# EAGLE design SD card module (EAGLE 5.03)
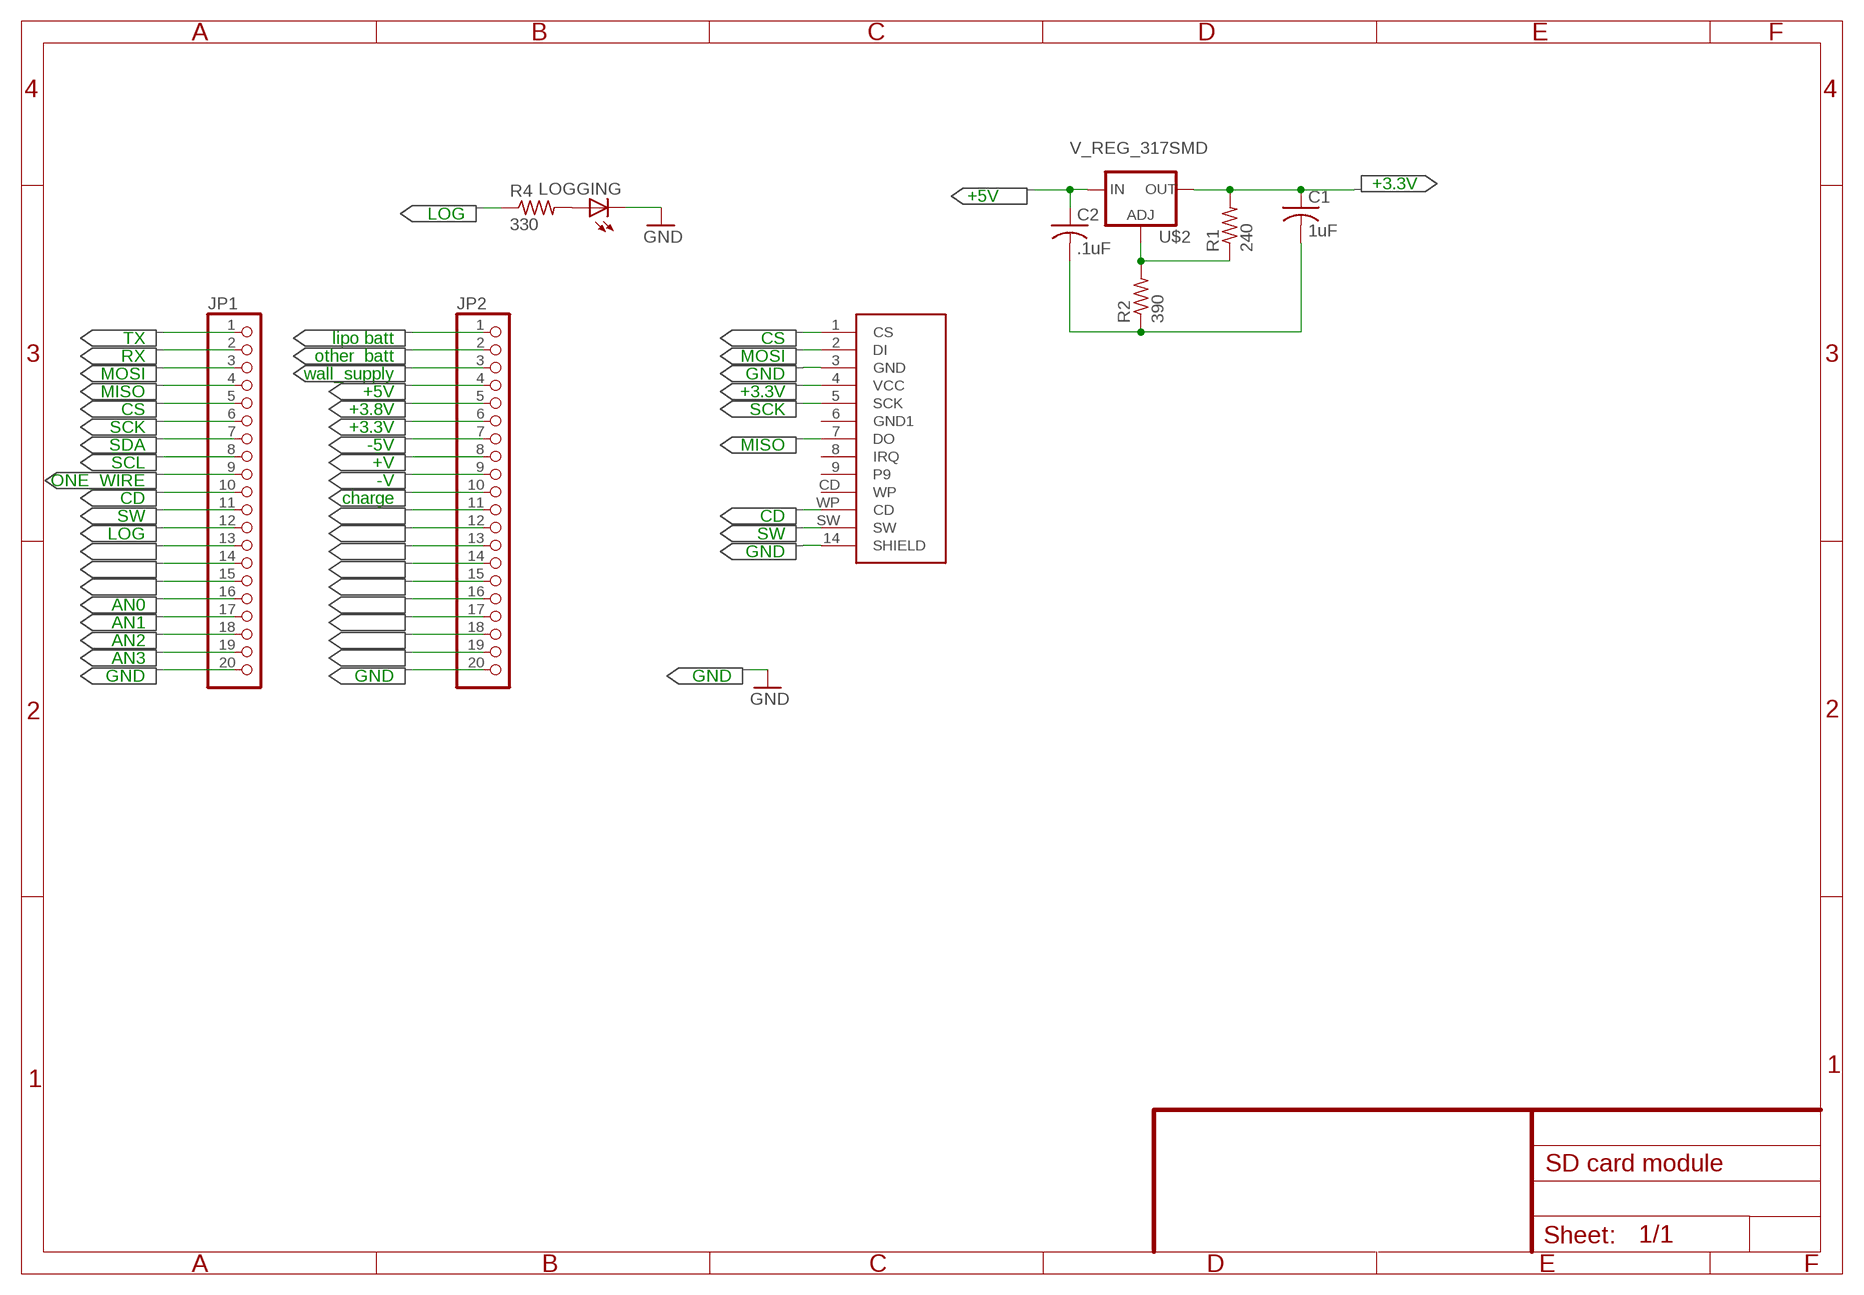
[diagram p0: schematic, sheet 1]

## Parts
C1  1uF  C-USC0603  [C0603]
C2  .1uF  C-USC0603  [C0603]
JP1  PINHD-1X20  [1X20]
JP2  PINHD-1X20  [1X20]
LOGGING  LEDCHIP-LED0603  [CHIP-LED0603]
R1  240  R-US_R0603  [R0603]
R2  390  R-US_R0603  [R0603]
R4  330  R-US_R0603  [R0603]
U$1  SD_CARD_SOCKETSD  [SD-MMC_SOCKET-PP]
U$2  V_REG_317SMD  [SOT223]

## Nets
+3.3V: C1.1 JP2.6 R1.2 U$1.4(VCC) U$2.2(OUT)
+5V: C2.1 JP2.4 U$2.3(IN)
+V: JP2.8
-5V: JP2.7
-V: JP2.9
ALARM: JP1.14
CD: JP1.10 U$1.WP(CD)
CHARGE: JP2.10
CS: JP1.5 U$1.1(CS)
GND: JP1.20 JP2.20 LOGGING.C U$1.3(GND) U$1.14(SHIELD)
LIPO_BATT: JP2.1
LOG: JP1.12 R4.1
MISO: JP1.4 U$1.7(DO)
MOSI: JP1.3 U$1.2(DI)
N$1: JP2.11
N$2: LOGGING.A R4.2
N$4: R1.1 R2.2 U$2.1(ADJ)
N$5: C1.2 C2.2 R2.1
N$6: JP2.12
N$7: JP2.13
N$11: JP2.14
N$12: JP2.15
N$13: JP2.16
N$14: JP2.17
N$15: JP2.18
N$16: JP2.19
N$32: JP1.15
N$33: JP1.16
N$34: JP1.17
N$35: JP1.18
N$36: JP1.19
ONE_WIRE: JP1.9
OTHER_BATT: JP2.2
RIN: JP1.13
RX: JP1.2
SCK: JP1.6 U$1.5(SCK)
SCL: JP1.8
SDA: JP1.7
SW: JP1.11 U$1.SW
TX: JP1.1
VCC: JP2.5
WALL_SUPPLY: JP2.3
Unconnected: U$1.6(GND1) U$1.8(IRQ) U$1.9 U$1.CD(WP)

## Notes on the sheet
- +5V | +3.3V
- LOG
- TX | lipo batt | CS
- RX | other_batt | MOSI
- MOSI | wall_supply | GND
- MISO | +5V | +3.3V
- CS | +3.8V | SCK
- SCK | +3.3V
- SDA | -5V | MISO
- SCL | +V
- ONE_WIRE | -V
- CD | charge
- SW | CD
- LOG | SW
- GND
- AN0
- AN1
- AN2
- AN3
- GND | GND | GND

## Library data of the parts
C1 C2 = rcl:C-US: CAPACITOR, American symbol
JP1 JP2 = pinhead:PINHD-1X20: PIN HEADER
LOGGING = led:LED: LED OSRAM: - CHIPLED LG R971, LG N971, LY N971, LG Q971, LY Q971, LO R971, LY R971 LH N974, LH R974 LS Q976, LO Q976, LY Q976 LO Q996 - Hyper CHIPLED LW Q18S LB Q993, LB Q99A, LB R99A - SideLED LS A670, LO A670, LY A670, LG A670, LP A670 LB A673, LV A673, LT A673, LW A673 LH A674 LY A675 LS A676, LA A676, LO A676, LY A676, LW A676 LS A679, LY A679, LG A679 - Hyper Micro SIDELED® LS Y876, LA Y876, LO Y876, LY Y876 LT Y87S - SmartLED LW L88C, LW L88S LB L89C, LB L89S, LG L890 LS L89K, LO L89K, LY L89K LS L896, LA L896, LO L896, LY L896 - TOPLED LS T670, LO T670, LY T670, LG T670, LP T670 LSG T670, LSP T670, LSY T670, LOP T670, LYG T670 LG T671, LOG T671, LSG T671 LB T673, LV T673, LT T673, LW T673 LH T674 LS T676, LA T676, LO T676, LY T676, LB T676, LH T676, LSB T676, LW T676 LB T67C, LV T67C, LT T67C, LS T67K, LO T67K, LY T67K, LW E67C LS E67B, LA E67B, LO E67B, LY E67B, LB E67C, LV E67C, LT E67C LW T67C LS T679, LY T679, LG T679 LS T770, LO T770, LY T770, LG T770, LP T770 LB T773, LV T773, LT T773, LW T773 LH T774 LS E675, LA E675, LY E675, LS T675 LS T776, LA T776, LO T776, LY T776, LB T776 LHGB T686 LT T68C, LB T68C - Hyper Mini TOPLED® LB M676 - Mini TOPLED Santana® LG M470 LS M47K, LO M47K, LY M47K Source: http://www.osram.convergy.de - LUMILED® LXK2-PW12-R00, LXK2-PW12-S00, LXK2-PW14-U00, LXK2-PW14-V00 LXK2-PM12-R00, LXK2-PM12-S00, LXK2-PM14-U00 LXK2-PE12-Q00, LXK2-PE12-R00, LXK2-PE12-S00, LXK2-PE14-T00, LXK2-PE14-U00 LXK2-PB12-K00, LXK2-PB12-L00, LXK2-PB12-M00, LXK2-PB14-N00, LXK2-PB14-P00, LXK2-PB14-Q00 LXK2-PR12-L00, LXK2-PR12-M00, LXK2-PR14-Q00, LXK2-PR14-R00 LXK2-PD12-Q00, LXK2-PD12-R00, LXK2-PD12-S00 LXK2-PH12-R00, LXK2-PH12-S00 LXK2-PL12-P00, LXK2-PL12-Q00, LXK2-PL12-R00 Source: www.luxeon.com
R1 R2 R4 = rcl:R-US_: RESISTOR, American symbol
U$1 = SparkFun:SD_CARD_SOCKET: SD/MMC Socket Media socket for SD and MMC cards. Push-push type. Schematic element and footprint production proven. Spark Fun Electronics SKU : PRT-00136
U$2 = SparkFun:V_REG_317: Voltage Regulator Standard LM317 adjustable voltage regulator. AOI (Adjust Output Input). Google 'LM317 Calculator' for easy to use app to get the two resistor values needed. 240/720 for 5V output. 240/390 for 3.3V output. Spark Fun Electronics SKU : COM-00527

## Board
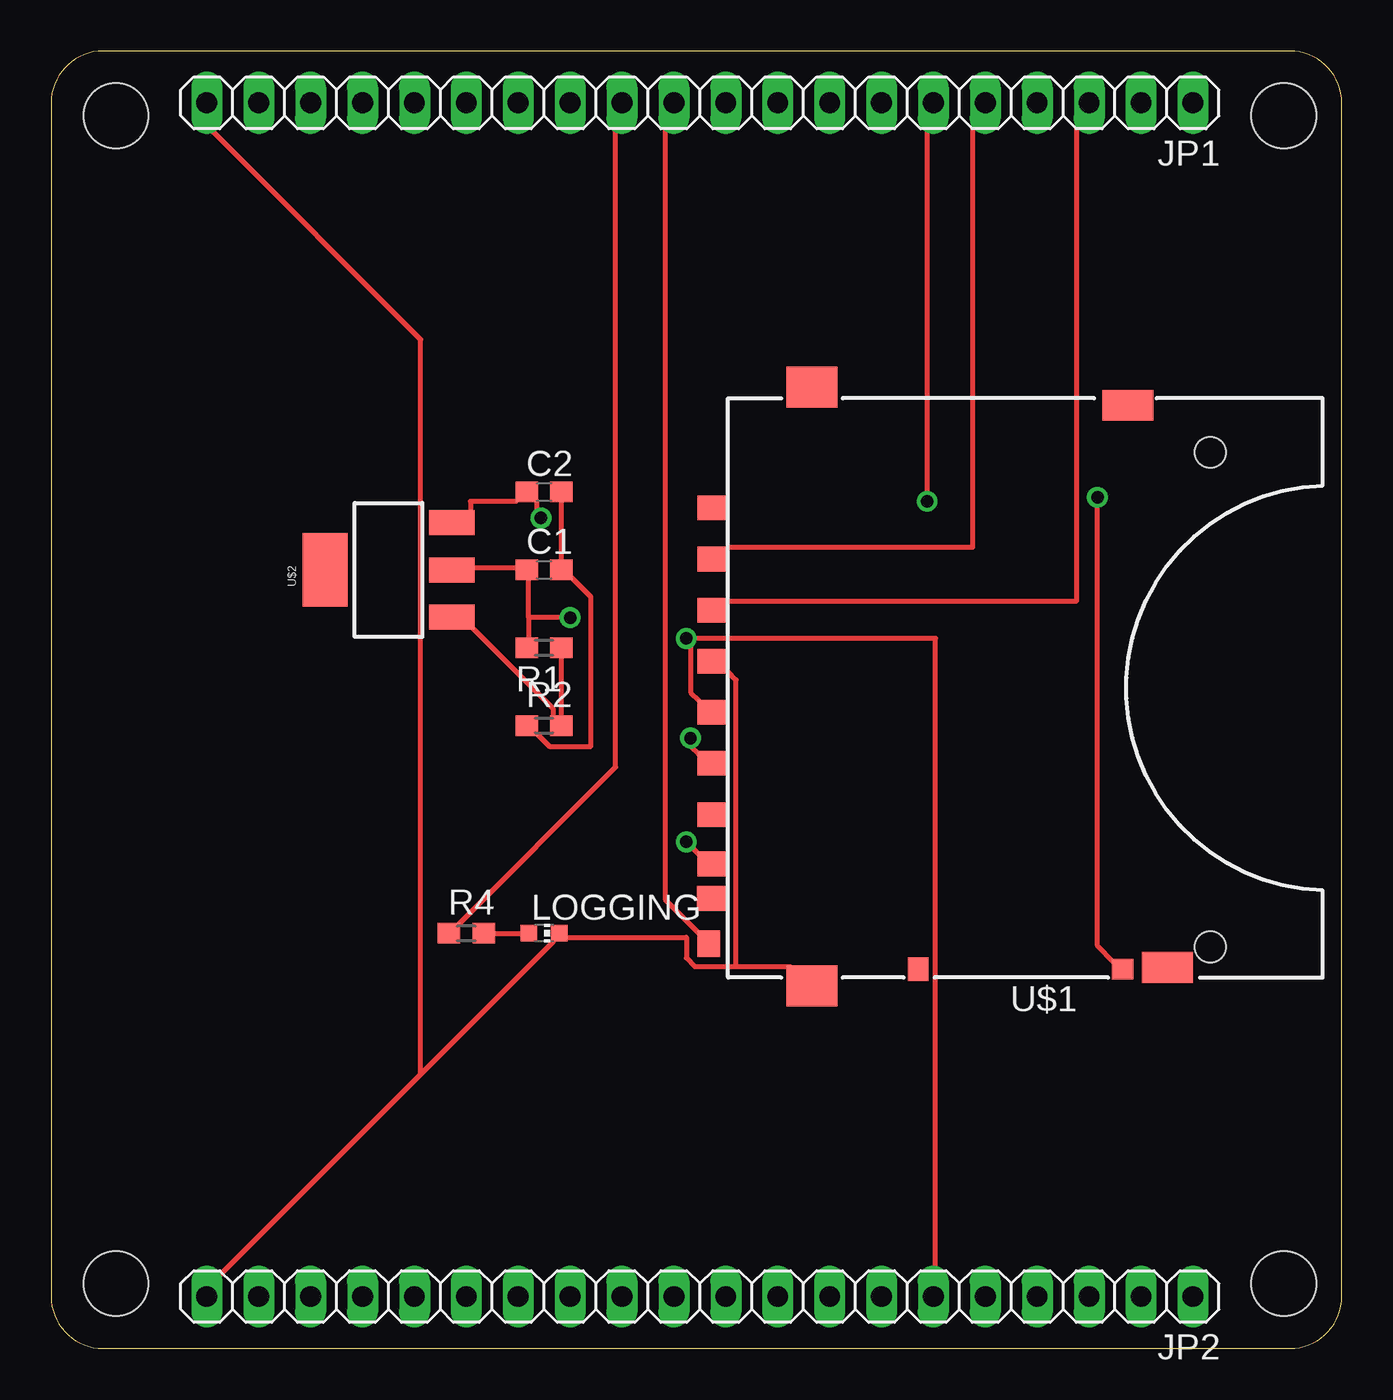
[diagram p1: board, top side]
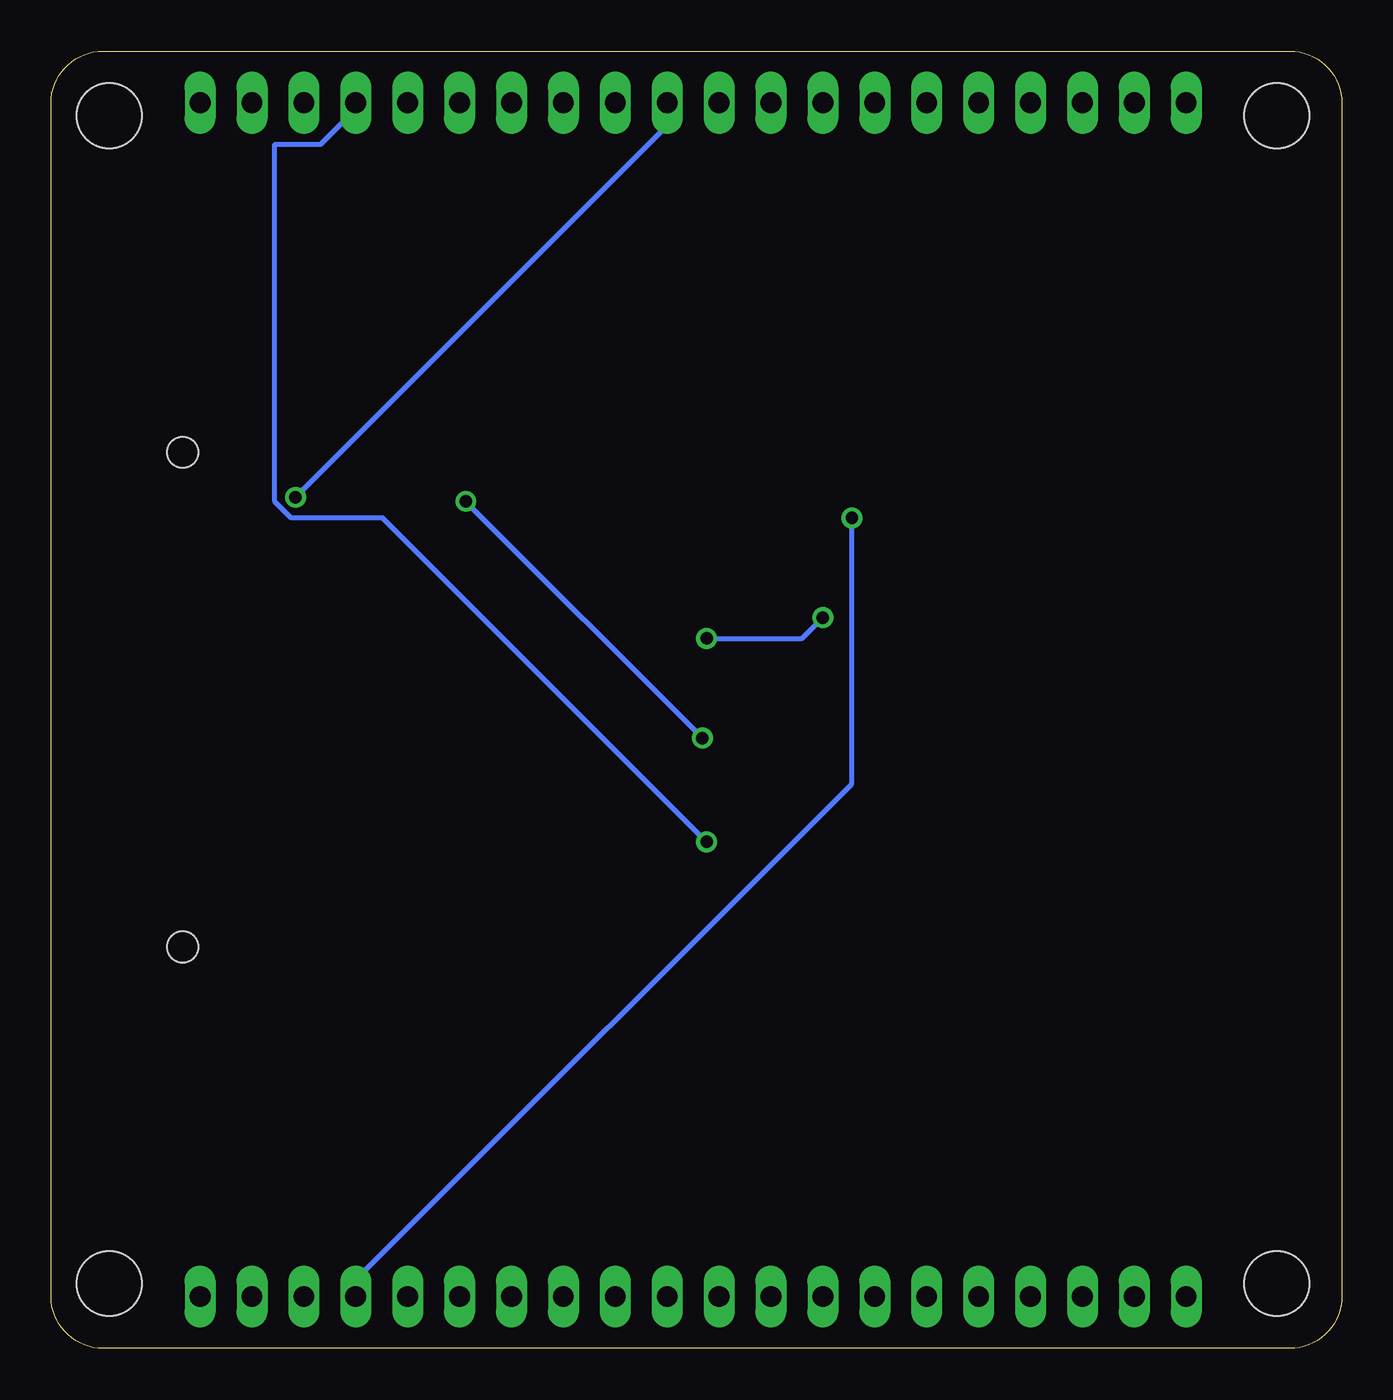
[diagram p2: board, bottom side, seen from below]

Size 63.17 x 63.49 mm. Coordinates in mm from the lower left corner, seen from the top.
Outline: 60.63,0 arc90 63.17,2.54 63.17,60.95 arc90 60.63,63.49 2.54,63.49 arc90 0,60.95 0,2.54 arc90 2.54,0 60.63,0
Copper layers (1*16): Top 0.035mm / dielectric 1.5mm / Bottom 0.035mm
Design rules "default": minimum track width 10mil, minimum drill 24mil, track to track 8mil, track to pad 8mil, pad to pad 8mil, via to via 8mil, smd to smd 8mil, copper to edge 40mil, drill to drill 8mil, minimum pad ring 10mil, minimum via ring 8mil, stop-mask expansion 4mil, vias tented up to drill 0mil, thermal gap 10mil
Holes 3.17 mm at 3.17,3.17 60.33,3.17 60.33,60.33 3.17,60.33

### Footprints (pad centres in the part's own frame; a part is rotated, then mirrored left to right if it is on the bottom)
C0603 = smd 1.1 x 1: 1 -0.85,0; 2 0.85,0
1X20 = drill 1.016 long: 1 -24.13,0; 2 -21.59,0; 3 -19.05,0; 4 -16.51,0; 5 -13.97,0; 6 -11.43,0; 7 -8.89,0; 8 -6.35,0; 9 -3.81,0; 10 -1.27,0; 11 1.27,0; 12 3.81,0; 13 6.35,0; 14 8.89,0; 15 11.43,0; 16 13.97,0; 17 16.51,0; 18 19.05,0; 19 21.59,0; 20 24.13,0
CHIP-LED0603 = smd 0.8 x 0.8: A 0,-0.75; C 0,0.75
R0603 = smd 1.1 x 1: 1 -0.85,0; 2 0.85,0
SD-MMC_SOCKET-PP = smd 1.2 x 1.5: 1 6.88,29.85; 2 4.38,29.85; 3 1.88,29.85; 4 -0.62,29.85; 5 -3.12,29.85; 6 -5.62,29.85; 7 -8.04,29.85; 8 -9.728,29.87; 9 9.38,29.85 | smd 1.5 x 2.5: 12 -13.1,7.6; 13 14.402,9.525 | smd 2 x 2.5: 14 -14,25; 15 15.3,25 | smd 1.15 x 1: CD -13.18,19.8 | smd 1.3 x 1.1: SW -11.938,30.048 | smd 1 x 1.05: WP -13.18,9.8 | hole 1.5: -12.1,5.5; 12.1,5.5
SOT223 = smd 1.219 x 2.235: 1 -2.311,-3.099; 2 0,-3.099; 3 2.311,-3.099 | smd 3.6 x 2.2: 4 0,3.099

### Placement (x,y rotation side)
C1  24.13,38.1 0 top
C2  24.13,41.91 0 top
JP1  31.75,60.96 180 top
JP2  31.75,2.54 180 top
LOGGING  24.13,20.32 270 top
R1  24.13,34.29 180 top
R2  24.13,30.48 0 top
R4  20.32,20.32 0 top
U$1  62.23,31.75 90 top
U$2  16.51,38.1 90 top

### Tracks (layer width: path | path; a pad name or v marks a point on that pad's centre or on a via)
+3.3V  (via drill 0.61)
  Top 0.254: 23.37,35.76 23.37,37.8 C1.1 22.76,38.2 20.52,38.2 U$2.2 | 23.37,35.76 23.37,34.75 R1.2 | 31.29,34.54 31.29,32.11 31.7,31.7 U$1.4 | 31.29,34.54 31.5,34.75 43.28,34.75 43.28,3.86 JP2.6 | v25.4,35.76 23.37,35.76 | 31.29,34.54 v31.09,34.75
  Bottom 0.254: v25.4,35.76 26.42,34.75 v31.09,34.75
+5V  (via drill 0.61)
  Top 0.254: U$2.3 20.52,40.84 20.52,41.45 22.76,41.45 C2.1 23.77,41.45 23.77,40.84 v23.98,40.64
  Bottom 0.254: v23.98,40.64 23.98,27.64 47.75,3.86 JP2.4
CD  (via drill 0.61)
  Top 0.254: v51.21,41.66 51.21,19.71 52.02,18.9 U$1.WP
  Bottom 0.254: v51.21,41.66 33.33,59.54 JP1.10
CS
  Top 0.254: U$1.1 33.12,39.22 45.11,39.22 45.11,59.74 JP1.5
GND
  Top 0.254: 33.53,18.69 36.17,18.69 U$1.14 | 33.53,18.69 31.5,18.69 31.09,19.1 31.09,20.12 25.2,20.12 LOGGING.C 24.59,20.12 24.59,19.91 18.09,13.41 | 33.53,18.69 33.53,32.72 33.12,33.12 U$1.3 | 18.09,13.41 8.33,3.66 JP2.20 | 18.09,13.41 18.09,49.38 7.92,59.54 JP1.20
LOG
  Top 0.254: R4.1 19.91,20.73 27.64,28.45 27.64,59.54 JP1.12
MISO  (via drill 0.61)
  Top 0.254: v31.09,24.79 31.7,24.18 U$1.7
  Bottom 0.254: v31.09,24.79 46.94,40.64 51.41,40.64 52.22,41.45 52.22,58.93 49.99,58.93 48.97,59.94 JP1.4
MOSI
  Top 0.254: U$1.2 33.12,36.58 50.19,36.58 50.19,59.74 JP1.3
N$2
  Top 0.254: R4.2 LOGGING.A
N$4
  Top 0.254: R1.1 24.99,33.93 24.99,30.89 R2.2 24.59,30.89 24.59,31.29 20.52,35.36 U$2.1
N$5
  Top 0.254: R2.1 23.77,30.07 24.38,29.46 26.42,29.46 26.42,36.78 25.4,37.8 C1.2 24.99,38.41 24.99,41.45 C2.2
SCK  (via drill 0.61)
  Top 0.254: v31.29,29.87 31.29,29.46 31.7,29.06 U$1.5 | v42.88,41.45 42.88,59.54 JP1.6
  Bottom 0.254: v31.29,29.87 v42.88,41.45
SW
  Top 0.254: U$1.SW 31.7,20.32 30.07,21.95 30.07,59.54 JP1.11